# Altium schematic sheet IO Peripherals.SchDoc: Peripherals
size A4; DocumentNumber: 6; SheetNumber: 7; SheetTotal: 7
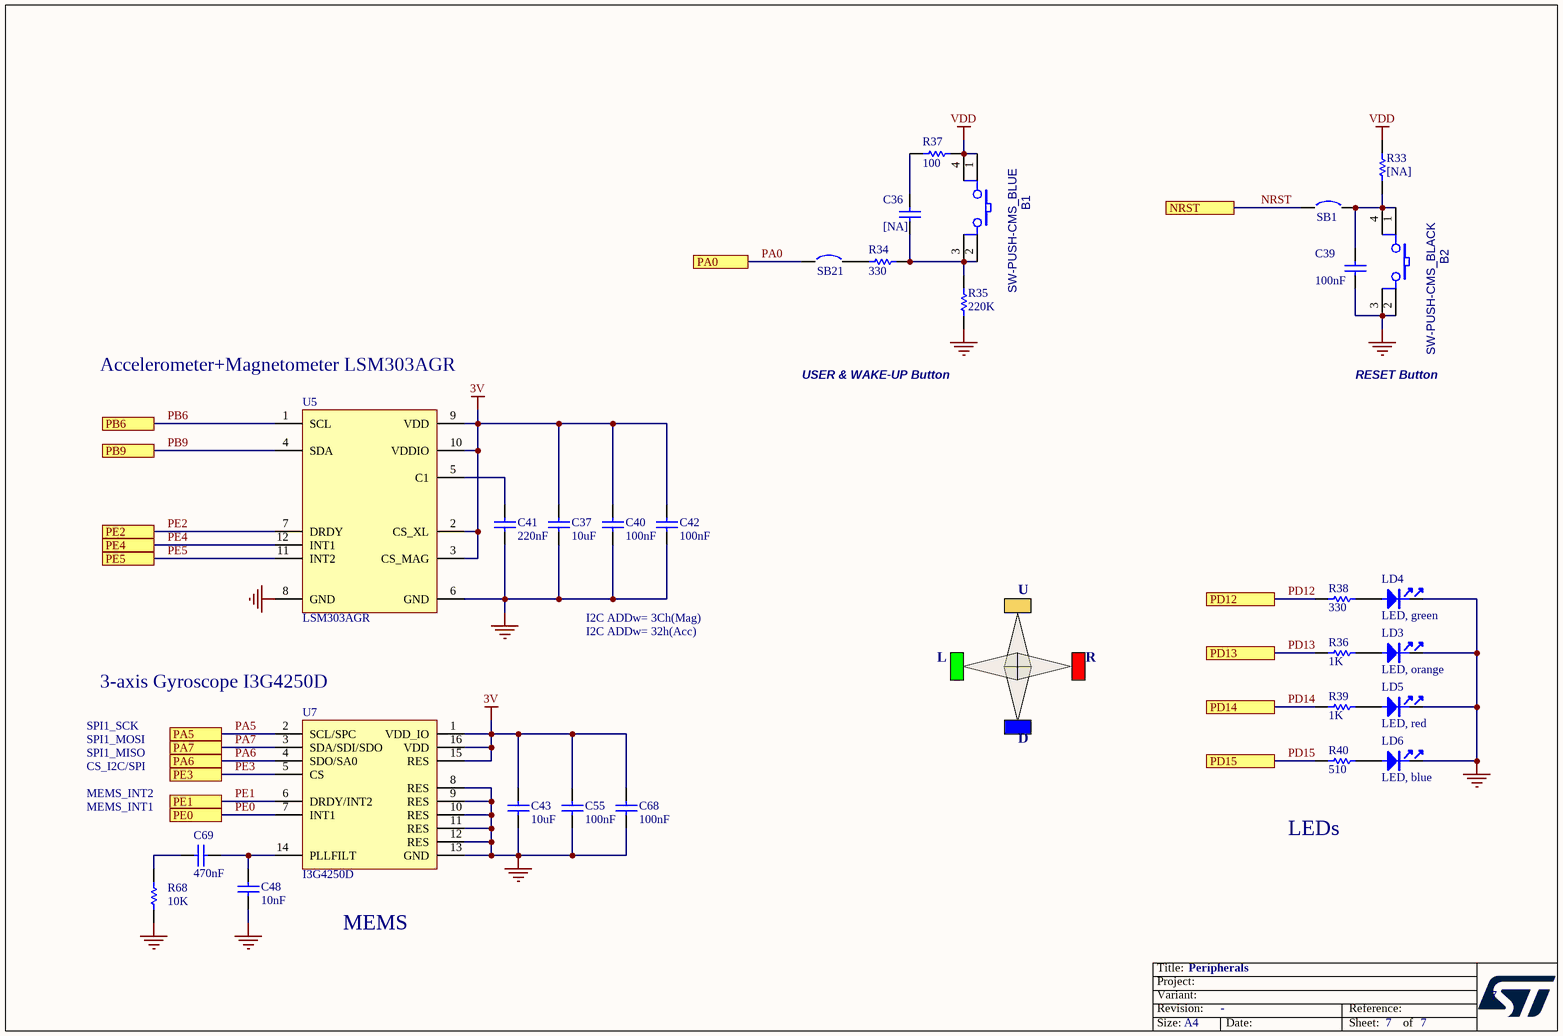
[diagram p0: IO Peripherals.SchDoc]

## Parts
B1  SW-PUSH-CMS_BLUE  [BP1CMS (Primary)]
B2  SW-PUSH-CMS_BLACK  [BP1CMS (Primary)]
C36  [NA]  [0402C (Primary)]
C37  10uF  [0603C (Primary)]
C39  100nF  [0402C (Primary)]
C40  100nF  [0402C (Primary)]
C41  220nF  [0603C (Primary)]
C42  100nF  [0402C (Primary)]
C43  10uF  [0603C (Primary)]
C48  10nF  [0603C (Primary)]
C55  100nF  [0402C (Primary)]
C68  100nF  [0402C (Primary)]
C69  value 470nF  [0603C (Primary)]  (hidden comment: Capacitor)
LD3  LED, orange  [0603D (Primary)]
LD4  LED, green  [0603D (Primary)]
LD5  LED, red  [0603D (Primary)]
LD6  LED, blue  [0603D (Primary)]
R33  [NA]  [0402R (Primary)]
R34  330  [0402R (Primary)]
R35  220K  [0402R (Primary)]
R36  1K  [0402R (Primary)]
R37  100  [0402R (Primary)]
R38  330  [0402R (Primary)]
R39  1K  [0402R (Primary)]
R40  510  [0402R (Primary)]
R68  10K  [0402R (Primary)]
SB1  Circuit Breaker  [JP2_SMD (Primary)]  (value not drawn)
SB21  Circuit Breaker  [JP2_SMD (Primary)]  (value not drawn)
U5  LSM303AGR  [ICC_LGA12_2X2_P050]
U7  I3G4250D  [ICC_LGA16_4X4_P065_H1P1]

## Ports
NRST, PA0, PA5, PA6, PA7, PB6, PB9, PD12, PD13, PD14, PD15, PE0, PE1, PE2, PE3, PE4, PE5

## Nets
3V: C37.2 C40.2 C42.2 C43.2 C55.2 C68.2 U5.2(CS_XL) U5.3(CS_MAG) U5.9(VDD) U5.10(VDDIO) U7.1(VDD_IO) U7.15(RES) U7.16(VDD)
GND: B2.2 B2.3 C37.1 C39.1 C40.1 C41.1 C42.1 C43.1 C48.1 C55.1 C68.1 LD3.2 LD4.2 LD5.2 LD6.2 R35.1 R68.2 U5.6(GND) U5.8(GND) U7.8(RES) U7.9(RES) U7.10(RES) U7.11(RES) U7.12(RES) U7.13(GND)
VDD: B1.1 B1.4 R33.2 R37.2
NRST: SB1.1 ; port NRST
PA0: SB21.1 ; port PA0
PA5: U7.2(SCL/SPC) ; port PA5
PA6: U7.4(SDO/SA0) ; port PA6
PA7: U7.3(SDA/SDI/SDO) ; port PA7
PB6: U5.1(SCL) ; port PB6
PB9: U5.4(SDA) ; port PB9
PD12: R38.2 ; port PD12
PD13: R36.2 ; port PD13
PD14: R39.2 ; port PD14
PD15: R40.2 ; port PD15
PE0: U7.7(INT1) ; port PE0
PE1: U7.6(DRDY/INT2) ; port PE1
PE2: U5.7(DRDY) ; port PE2
PE3: U7.5(CS) ; port PE3
PE4: U5.12(INT1) ; port PE4
PE5: U5.11(INT2) ; port PE5
NetB1_2: B1.2 B1.3 C36.1 R34.2 R35.2
NetB2_1: B2.1 B2.4 C39.2 R33.1 SB1.2
NetC36_2: C36.2 R37.1
NetC41_2: C41.2 U5.5(C1)
NetC48_2: C48.2 C69.1 U7.14(PLLFILT)
NetC69_2: C69.2 R68.1
NetLD3_1: LD3.1 R36.1
NetLD4_1: LD4.1 R38.1
NetLD5_1: LD5.1 R39.1
NetLD6_1: LD6.1 R40.1
NetR34_1: R34.1 SB21.2

## Notes on the sheet
- (near U5) Accelerometer+Magnetometer LSM303AGR
- USER & WAKE-UP Button
- RESET Button
- I2C ADDw= 3Ch(Mag)
- I2C ADDw= 32h(Acc)
- U
- (near U7) 3-axis Gyroscope I3G4250D
- L
- R
- SPI1_MOSI
- SPI1_SCK
- SPI1_MISO
- CS_I2C/SPI
- D
- MEMS_INT1
- MEMS_INT2
- LEDs
- MEMS
- Title:
- Project:
- Size:
- Revision:
- Variant:
- A4
- -
- Date:
- Reference:
- Sheet:
- of

## Library data of the parts
B1 = SW-PUSH-CMS_BLUE: Non-Open Push-Button 0.1A 24V; Manuf_2: FARNELL; Manuf_Part_2: 535-930; Manuf_1: wealthmetal; Manuf_Part_1: TD0341X-G01-BLU; Ref St: 9180120; Footprint: BP1CMS; Distrib: *
B2 = SW-PUSH-CMS_BLACK: Non-Open Push-Button 0.1A 24V; Manuf_2: FARNELL; Manuf_Part_2: 535-930; Manuf_1: wealthmetal; Manuf_Part_1: TD0341X-G01-BLA; Ref St: 9180120; Footprint: BP1CMS; Distrib: *
C36 = Cap_NA_0402: Capacitor,NA,0402; Fitted: NO; Revision: July-2002: Re-released for DXP Platform.; Value: [NA]
C37 C43 = Cap_10uF_X5R_10%_0603: Capacitor,10uF,6.3V,X5R,20%,0603,YAGEO; Manuf_Part_1: CC0603KRX5R5BB106; Revision: July-2002: Re-released for DXP Platform.; Value: 10uF; Order: CC0603KRX5R5BB106; Manuf_1: YAGEO
C39 C40 C42 C55 C68 = Cap_100nF_X7R_10%_0402: Capacitor,100nF,16V,X7R,10%,0402,YAGEO; Manuf_Part_1: CC0402KRX7R7BB104; Revision: July-2002: Re-released for DXP Platform.; Value: 100nF; Order: CC0402KRX7R7BB104; Manuf_1: YAGEO
C41 = Cap_220nF_X7R_10%_0603: Capacitor,220nF,16V,X7R,10%,0603,YAGEO; Manuf_Part_1: CC0603KRX7R7BB224; Revision: July-2002: Re-released for DXP Platform.; Value: 220nF; Order: CC0603KRX7R7BB224; Manuf_1: YAGEO
C48 = Cap_10nF_X7R_10%_0603: Capacitor,10nF,50V,X7R,10%,0603,YAGEO; Manuf_Part_1: CC0603KRX7R9BB103; Revision: July-2002: Re-released for DXP Platform.; Value: 10nF; Order: CC0603KRX7R9BB103; Manuf_1: YAGEO
C69 = MCD-01006: Capacitor, MLCC, 470nF, 16V, X7R, 10%, 0603, T=0.8mm; Manufacturer_Part_Number: CC0603KRX7R7BB474; Manufacturer: YAGEO; BMS_Part_Number: 9142003; Provided_By: SUBCO; Internal_Part_Number: MCD-01006; Status: Released; Part_Type: Capacitor; Package: C0603; ComponentLink1Description: Datasheet; ComponentLink1URL: http://tunmcdsvn.tun.st.com/Component_Datasheet_Library/Trunk/Capacitors/Yageo_Multilayer_Capacitor_X7R_series_100pF_to_22uF/; ECCN_US: N/A; ECCN_EU: N/A
LD3 = LED_orange: LED, orange, 0603; Manuf_1: everlight; Manuf_Part_1: 19-217/S2C-AM2N2VY/3T; Order: 19-217/S2C-AM2N2VY/3T
LD4 = LED_green: LED, green, 0603; Manuf_1: everlight; Manuf_Part_1: 19-213SYGC/S530-E2/TR8; Order: 19-213SYGC/S530-E2/TR8
LD5 = LED_red: LED, red, 0603; Manuf_1: everlight; Manuf_Part_1: 19-213-R6C-AP1Q2B/3T; Order: 19-213-R6C-AP1Q2B/3T
LD6 = LED_blue: LED, blue, 0603; Manuf_1: everlight; Manuf_Part_1: 19-217/BHC-ZL1M2RY/3T; Order: 19-217/BHC-ZL1M2RY/3T
R33 = Res_NA_0402: Resistor,[NA],0402; Fitted: NO; Value: [NA]
R34 R68 = res1: Resistor; Published: 8-Jun-2000; Revision: July-2002: Re-released for DXP Platform.; Publisher: Altium Limited
  R34: Value: 330
  R68: Value: 10K
R35 = res1: Resistor; Value: 10K; Published: 8-Jun-2000; Revision: July-2002: Re-released for DXP Platform.; Publisher: Altium Limited
R36 R39 = Res1: Resistor; Published: 8-Jun-2000; Revision: July-2002: Re-released for DXP Platform.; Publisher: Altium Limited; Value: 1K
R37 = res1: Resistor; Value: 330; Published: 8-Jun-2000; Revision: July-2002: Re-released for DXP Platform.; Publisher: Altium Limited
R38 R40 = Res1: Resistor; Value: 1K; Published: 8-Jun-2000; Revision: July-2002: Re-released for DXP Platform.; Publisher: Altium Limited
SB1 SB21 = Circuit Breaker: Solder: YES; Revision: July-2002: Re-released for DXP Platform.
U5 = MCD-00709: 3D accelerometer and 3D magnetometer; Part_Type: IC; Manufacturer: STMICROELECTRONICS; BMS_Part_Number: 9177057; ECCN_US: EAR99; ECCN_EU: NEC; Provided_By: SUBCO with ST control; Internal_Part_Number: MCD-00709; Value: LSM303AGR; Status: Checked; Manufacturer_Part_Number: LSM303AGR; ComponentLink1Description: Datasheet; ComponentLink1URL: http://tunmcdsvn.tun.st.com/Component_Datasheet_Library/Trunk/IC/STM_IC_magnetometer_LSM303AGR
U7 = MCD-01963: MEMS motion sensor: 3-axis digital output gyroscope LG4-16 4x4mm; Part_Type: IC; Manufacturer: STMICROELECTRONICS; Order_Code_RS: 166-1109; ECCN_US: EAR99; ECCN_EU: NEC; Provided_By: SUBCO with ST control; Internal_Part_Number: MCD-01963; Value: I3G4250D; Status: Checked; Manufacturer_Part_Number: I3G4250D; Alternate_Manufacturer_Part_Number: N/A; Alternate_Manufacturer: N/A; Package: LGA-16; ComponentLink1Description: Datasheet; ComponentLink1URL: http://tunmcdsvn.tun.st.com/Component_Datasheet_Library/Trunk/IC/STM_I3G4250D_MEMS_3_axis_gyroscope; Order_Code_Digikey: I3G4250D-ND; Order_Code_Farnell: 2532375